# Altium schematic sheet Alarm system.SchDoc: Portable soldering station
size A3; SheetTotal: 1
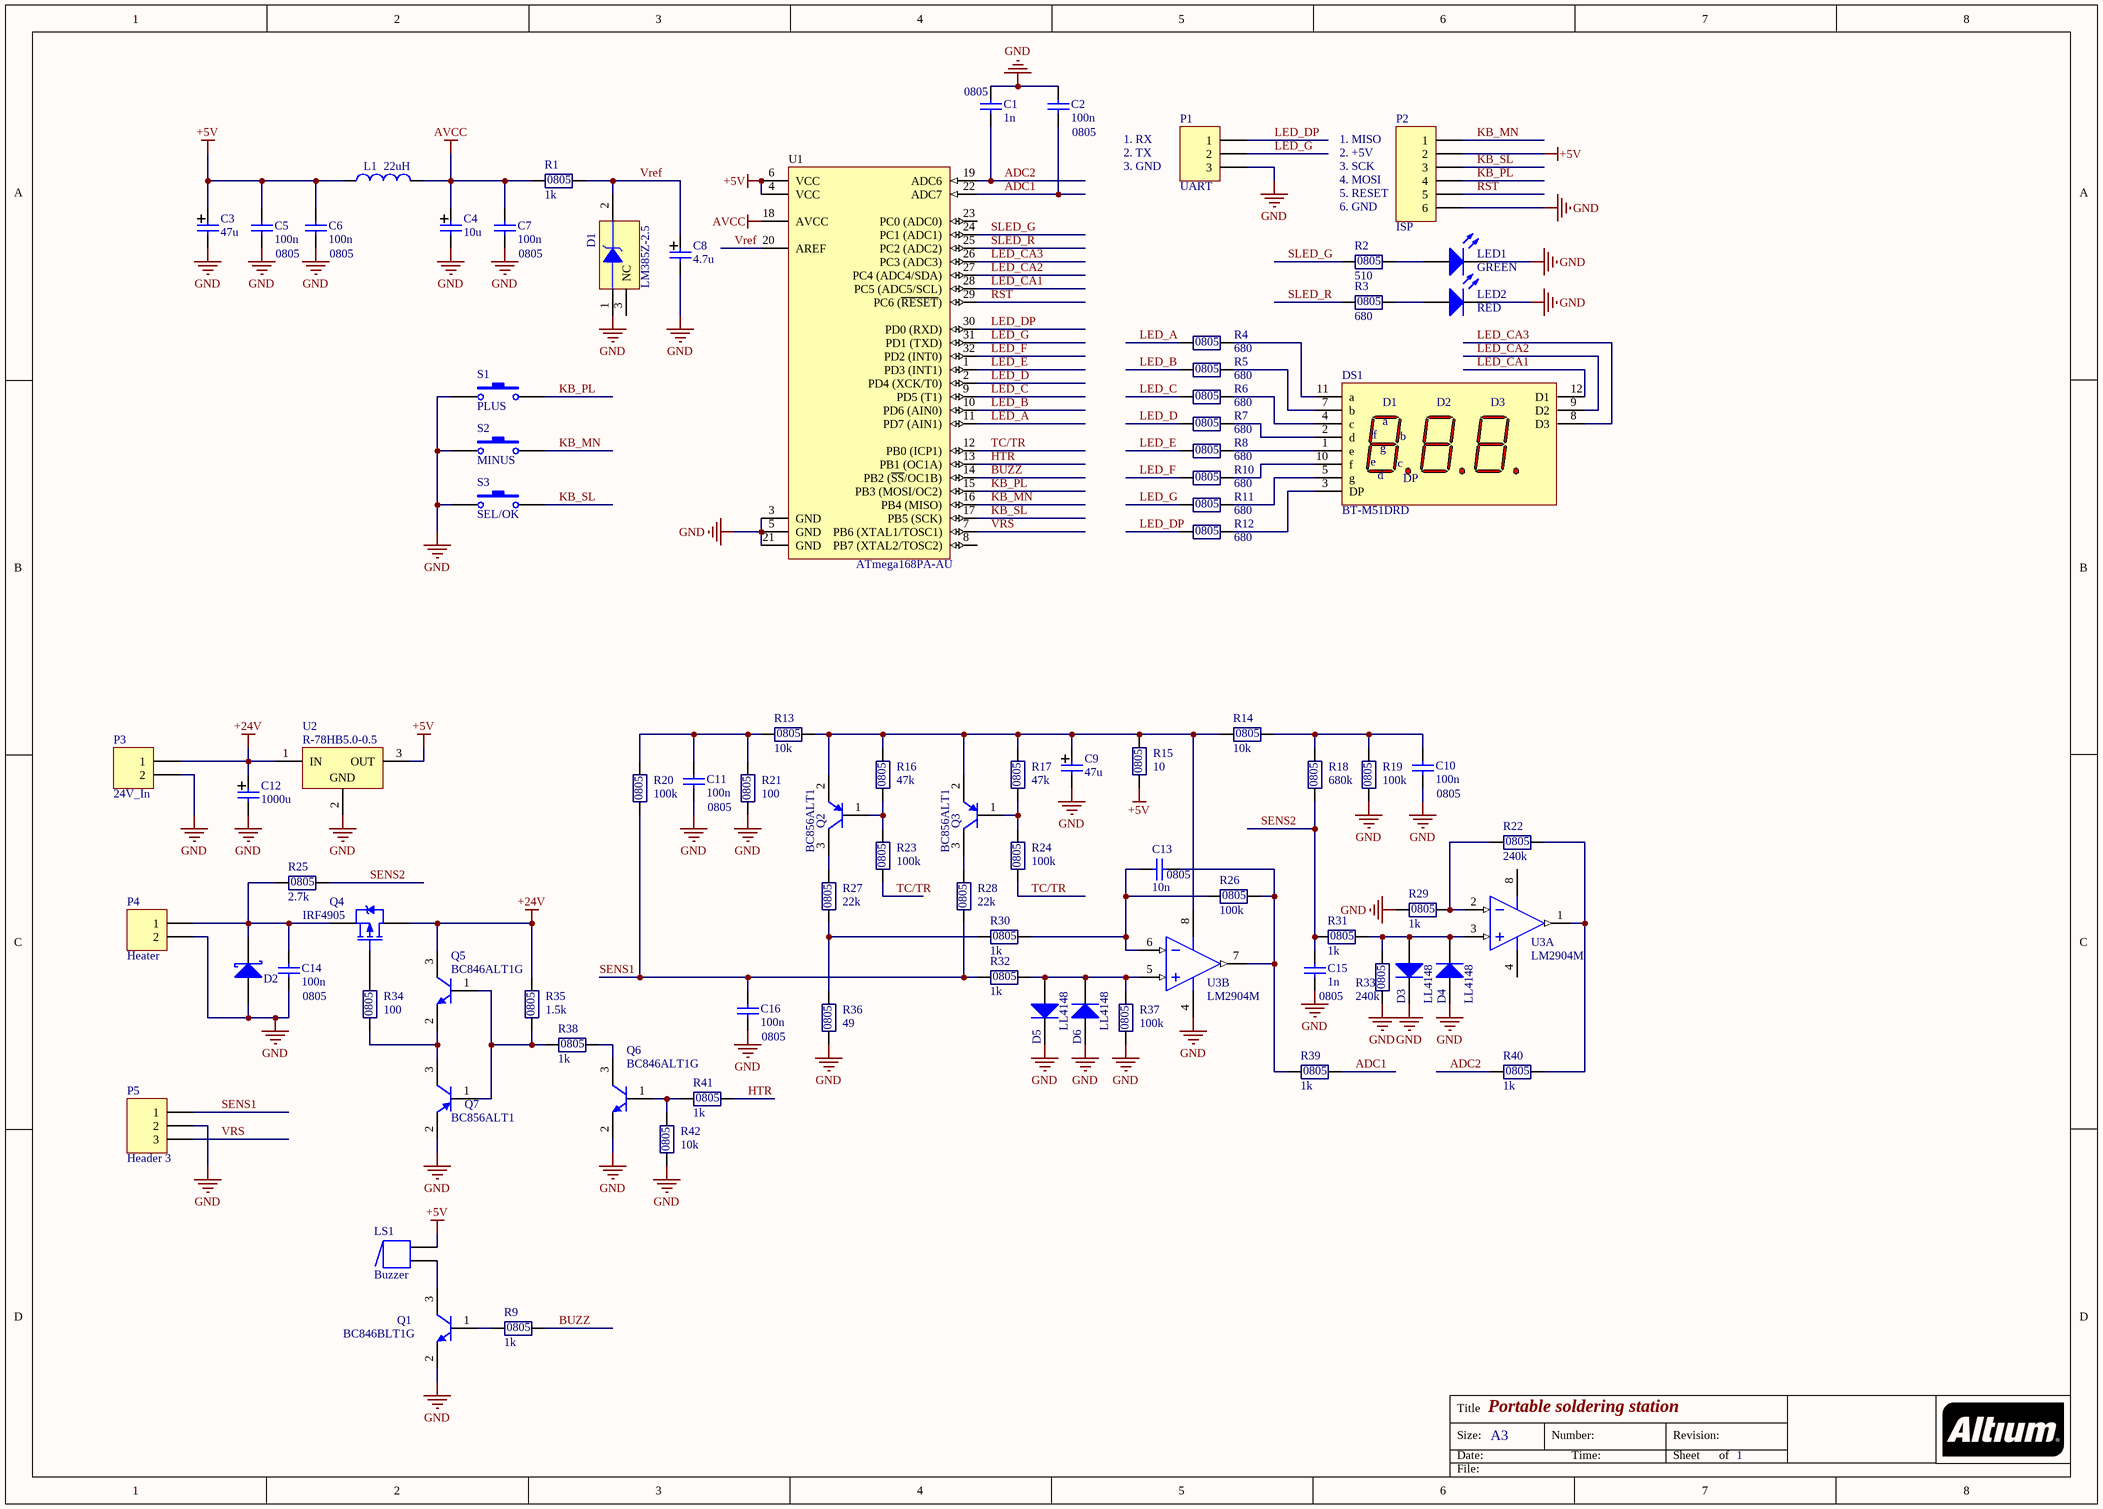
[diagram p0: Alarm system.SchDoc]

## Parts
C1  0805  value 1n  [CAPC2012X110N]
C2  0805  value 100n  [CAPC2012X110N]
C3  value 47u  [CAPPR250-500X1100]  (hidden comment: CAP_POL)
C4  value 10u  [CAPPR250-500X1100]  (hidden comment: CAP_POL)
C5  0805  value 100n  [CAPC2012X110N]
C6  0805  value 100n  [CAPC2012X110N]
C7  0805  value 100n  [CAPC2012X110N]
C8  value 4.7u  [CAPPR250-500X1100]  (hidden comment: CAP_POL)
C9  value 47u  [CAPPR250-500X1100]  (hidden comment: CAP_POL)
C10  0805  value 100n  [CAPC2012X110N]
C11  0805  value 100n  [CAPC2012X110N]
C12  value 1000u  [CAPPR500-1300X2150]  (hidden comment: CAP_POL)
C13  0805  value 10n  [CAPC2012X110N]
C14  0805  value 100n  [CAPC2012X110N]
C15  0805  value 1n  [CAPC2012X110N]
C16  0805  value 100n  [CAPC2012X110N]
D1  LM385Z-2.5  [TO-92AA-P127]
D2  Schottky  [DO-41]  (value not drawn)
D3  LL4148  [SOD80]
D4  LL4148  [SOD80]
D5  LL4148  [SOD80]
D6  LL4148  [SOD80]
DS1  BT-M51DRD  [BT-M51DRD]
L1  22uH  [IND_BOURNS_PM43]
LED1  GREEN  [LED_3MM_GREEN_1C-2A]
LED2  RED  [LED_3MM_RED_1C-2A]
LS1  Buzzer  [buzzer]
P1  UART  [961103-6404-AR]
P2  ISP  [961106-6404-AR]
P3  24V_In  [PHOENIX_1715721]
P4  Heater  [PHOENIX_1715721]
P5  Header 3  [961103-6404-AR]
Q1  BC846BLT1G  [SOT95P230X110-3N]
Q2  BC856ALT1  [SOT95P230X110-3N]
Q3  BC856ALT1  [SOT95P230X110-3N]
Q4  IRF4905  [TO-220AB]
Q5  BC846ALT1G  [SOT95P230X110-3N]
Q6  BC846ALT1G  [SOT95P230X110-3N]
Q7  BC856ALT1  [SOT95P230X110-3N]
R1  0805  value 1k  [RESC2012X50N]
R2  0805  value 510  [RESC2012X50N]
R3  0805  value 680  [RESC2012X50N]
R4  0805  value 680  [RESC2012X50N]
R5  0805  value 680  [RESC2012X50N]
R6  0805  value 680  [RESC2012X50N]
R7  0805  value 680  [RESC2012X50N]
R8  0805  value 680  [RESC2012X50N]
R9  0805  value 1k  [RESC2012X50N]
R10  0805  value 680  [RESC2012X50N]
R11  0805  value 680  [RESC2012X50N]
R12  0805  value 680  [RESC2012X50N]
R13  0805  value 10k  [RESC2012X50N]
R14  0805  value 10k  [RESC2012X50N]
R15  0805  value 10  [RESC2012X50N]
R16  0805  value 47k  [RESC2012X50N]
R17  0805  value 47k  [RESC2012X50N]
R18  0805  value 680k  [RESC2012X50N]
R19  0805  value 100k  [RESC2012X50N]
R20  0805  value 100k  [RESC2012X50N]
R21  0805  value 100  [RESC2012X50N]
R22  0805  value 240k  [RESC2012X50N]
R23  0805  value 100k  [RESC2012X50N]
R24  0805  value 100k  [RESC2012X50N]
R25  0805  value 2.7k  [RESC2012X50N]
R26  0805  value 100k  [RESC2012X50N]
R27  0805  value 22k  [RESC2012X50N]
R28  0805  value 22k  [RESC2012X50N]
R29  0805  value 1k  [RESC2012X50N]
R30  0805  value 1k  [RESC2012X50N]
R31  0805  value 1k  [RESC2012X50N]
R32  0805  value 1k  [RESC2012X50N]
R33  0805  value 240k  [RESC2012X50N]
R34  0805  value 100  [RESC2012X50N]
R35  0805  value 1.5k  [RESC2012X50N]
R36  0805  value 49  [RESC2012X50N]
R37  0805  value 100k  [RESC2012X50N]
R38  0805  value 1k  [RESC2012X50N]
R39  0805  value 1k  [RESC2012X50N]
R40  0805  value 1k  [RESC2012X50N]
R41  0805  value 1k  [RESC2012X50N]
R42  0805  value 10k  [RESC2012X50N]
S1  PLUS  [PB_OMRON_B3F-1070]
S2  MINUS  [PB_OMRON_B3F-1070]
S3  SEL/OK  [PB_OMRON_B3F-1070]
U1  ATmega168PA-AU  [32A_N]
U2  R-78HB5.0-0.5  [SIP-3]
U3  LM2904M  [M08A_N]  (parts A,B of 2)

## Nets
+5V: C3.1 C5.2 C6.2 L1.2 LS1.1 P2.2 R15.1 U1.4(VCC) U1.6(VCC) U2.3(OUT)
+24V: C12.1 P3.1 Q4.2(D) Q5.3(C) R35.2 U2.1(IN)
AVCC: C4.1 C7.2 L1.1 R1.1 U1.18(AVCC)
GND: C1.1 C2.1 C3.2 C4.2 C5.1 C6.1 C7.1 C8.2 C9.2 C10.1 C11.1 C12.2 C14.1 C15.1 C16.1 D1.1(A) D2.1(A) D3.2(K) D4.1(A) D5.2(K) D6.1(A) LED1.2(K) LED2.2(K) P1.3 P2.6 P3.2 P4.2 P5.2 Q1.2(E) Q6.2(E) Q7.2(E) R19.1 R21.1 R29.1 R33.1 R36.1 R37.1 R42.1 S1.1 S2.1 S3.1 U1.3(GND) U1.5(GND) U1.21(GND) U2.2(GND) U3.4(GND)
ADC1: C2.2 R39.2 U1.22(ADC7)
ADC2: C1.2 R40.1 U1.19(ADC6)
BUZZ: R9.2 U1.14(PB2_(~{SS}/OC1B))
HTR: R41.2 U1.13(PB1_(OC1A))
KB_MN: P2.1 S2.2 U1.16(PB4_(MISO))
KB_PL: P2.4 S1.2 U1.15(PB3_(MOSI/OC2))
KB_SL: P2.3 S3.2 U1.17(PB5_(SCK))
LED_A: R4.1 U1.11(PD7_(AIN1))
LED_B: R5.1 U1.10(PD6_(AIN0))
LED_C: R6.1 U1.9(PD5_(T1))
LED_CA1: DS1.12(D1) U1.28(PC5_(ADC5/SCL))
LED_CA2: DS1.9(D2) U1.27(PC4_(ADC4/SDA))
LED_CA3: DS1.8(D3) U1.26(PC3_(ADC3))
LED_D: R7.1 U1.2(PD4_(XCK/T0))
LED_DP: P1.1 R12.1 U1.30(PD0_(RXD))
LED_E: R8.1 U1.1(PD3_(INT1))
LED_F: R10.1 U1.32(PD2_(INT0))
LED_G: P1.2 R11.1 U1.31(PD1_(TXD))
RST: P2.5 U1.29(PC6_(~{RESET}))
SENS1: C16.2 P5.1 R20.1 R28.1 R32.1
SENS2: C15.2 R18.1 R25.2 R31.1
SLED_G: R2.1 U1.24(PC1_(ADC1))
SLED_R: R3.1 U1.25(PC2_(ADC2))
TC/TR: R23.1 R24.1 U1.12(PB0_(ICP1))
Vref: C8.1 D1.2(K) R1.2 U1.20(AREF)
VRS: P5.3 U1.7(PB6_(XTAL1/TOSC1))
NetC9_1: C9.1 Q2.2(E) Q3.2(E) R13.2 R14.1 R15.2 R16.2 R17.2 U3.8(V+)
NetC10_2: C10.2 R14.2 R18.2 R19.2
NetC11_2: C11.2 R13.1 R20.2 R21.2
NetC13_1: C13.1 R26.2 R39.1 U3.7(OUTB)
NetC13_2: C13.2 R26.1 R30.2 U3.6(INB-)
NetC14_2: C14.2 D2.2(K) P4.1 Q4.3(S) R25.1
NetD3_1: D3.1(A) D4.2(K) R31.2 R33.2 U3.3(INA+)
NetD5_1: D5.1(A) D6.2(K) R32.2 R37.2 U3.5(INB+)
NetDS1_1: DS1.1(e) R8.2
NetDS1_2: DS1.2(d) R7.2
NetDS1_3: DS1.3(DP) R12.2
NetDS1_4: DS1.4(c) R6.2
NetDS1_5: DS1.5(g) R11.2
NetDS1_7: DS1.7(b) R5.2
NetDS1_10: DS1.10(f) R10.2
NetDS1_11: DS1.11(a) R4.2
NetLED1_1: LED1.1(A) R2.2
NetLED2_1: LED2.1(A) R3.2
NetLS1_2: LS1.2 Q1.3(C)
NetQ1_1: Q1.1(B) R9.1
NetQ2_1: Q2.1(B) R16.1 R23.2
NetQ2_3: Q2.3(C) R27.2
NetQ3_1: Q3.1(B) R17.1 R24.2
NetQ3_3: Q3.3(C) R28.2
NetQ4_1: Q4.1(G) R34.2
NetQ5_1: Q5.1(B) Q7.1(B) R35.1 R38.1
NetQ5_2: Q5.2(E) Q7.3(C) R34.1
NetQ6_1: Q6.1(B) R41.1 R42.2
NetQ6_3: Q6.3(C) R38.2
NetR22_1: R22.1 R29.2 U3.2(INA-)
NetR22_2: R22.2 R40.2 U3.1(OUTA)
NetR27_1: R27.1 R30.1 R36.2

Not connected (* = marked no-connect by the designer): D1 3(NC); U1 8(PB7_(XTAL2/TOSC2)) 23(PC0_(ADC0))

## Notes on the sheet
- 1. RX
- 2. TX
- 3. GND
- 1. MISO
- 2. +5V
- 3. SCK
- 4. MOSI
- 5. RESET
- 6. GND
- Title
- Size:
- Date:
- A3
- Number:
- Time:
- Revision:
- Sheet
- of
- File:

## Library data of the parts
C1 C2 C5-C7 C10 C11 C13-C16 = CAP: MANUFACTURER P/N: *; MANUFACTURER: *
D1 = LM385Z-2.5: Micropower Voltage Reference Diode; Published: 17-Jul-2002; DatasheetVersion: 1988; PackageVersion: 1996; PackageReference: 29-04; Publisher: Altium Limited; PackageDescription: TO, Flat Index; 3 In-Line, Axial Leads; Body Dia. 4.8mm; Leads 0.48 x 0.5 mm (max); ComponentLink1Description: Manufacturer Link; ComponentLink1URL: http://www.onsemi.com/site/products/taxonomy/0,4438,503,00.html; ComponentLink2Description: Datasheet; ComponentLink2URL: http://www.onsemi.com/pub/Collateral/LM285-D.PDF
D2 = Schottky: Schottky Rectifier
D3-D6 = Diode
DS1 = Led_Ind_3_Digit
L1 = Drossel_AX
LED1 LED2 = LED0: Typical INFRARED GaAs LED; Published: 8-Jun-2000; LatestRevisionDate: 08-Jul-2005; LatestRevisionNote: Mech Layer 1 removed.; PackageReference: LED-0; Publisher: Altium Limited; PackageDescription: LED; 2 Leads
LS1 = Buzzer: Magnetic Transducer Buzzer; Published: 24-Mar-1999; LatestRevisionDate: 17-Dec-2003; LatestRevisionNote: Schematic revised, PCB Footprint replaced.; DatasheetVersion: 17-Dec-2003; PackageReference: ABSM-1574; Publisher: Altium Limited; PackageDescription: Magnetic Transducer Buzzer; ComponentLink1Description: Manufacturer Link; ComponentLink1URL: http://www.megastar.com/linecard/buzzmode/index.php
P1 P5 = Header 3: Header, 3-Pin; LatestRevisionDate: 17-Jul-2002; LatestRevisionNote: Re-released for DXP Platform.; Publisher: Altium Limited
P2 = Header 6: Header, 6-Pin; LatestRevisionDate: 17-Jul-2002; LatestRevisionNote: Re-released for DXP Platform.; Publisher: Altium Limited
P3 P4 = Header 2: Header, 2-Pin; LatestRevisionDate: 17-Jul-2002; LatestRevisionNote: Re-released for DXP Platform.; Publisher: Altium Limited
Q1 = BC846BLT1G: General Purpose Transistor, NPN Silicon, 3-Pin SOT-23, Pb-Free, Tape and Reel; Manufacturer: On Semiconductor; fT Min (MHz): 100; IC Continuous (A): 0.1; DatasheetVersion: Rev. 11; PackageVersion: Rev. AP, 11/2009; PackageReference: SOT-23-3-318-08; PackageDescription: 3-Pin Small Outline Transistor, Body 2.92 x 1.3 mm, Pitch 0.95 mm; Supplier 1: Digi-Key; Supplier Part Number 1: BC846BLT1GOSTR-ND; Supplier 2: Digi-Key; Supplier Part Number 2: BC846BLT1GOSCT-ND; Supplier 3: Digi-Key; Supplier Part Number 3: BC846BLT1GOSDKR-ND; Supplier 4: Farnell; Supplier Part Number 4: 2317817; Supplier 5: Newark; Supplier Part Number 5: 67R1292; Supplier 6: Newark; Supplier Part Number 6: 88H4565; Supplier 7: Mouser; Supplier Part Number 7: 863-BC846BLT1G; Packing: Tape and Reel; Polarity: NPN; RoHS: TRUE; Mounting Technology: Surface Mount; PartNumber: BC846BLT1G; ComponentLink1Description: Manufacturer URL; ComponentLink1URL: http://www.onsemi.com/; ComponentLink2Description: Datasheet; ComponentLink2URL: http://www.onsemi.cn/pub_link/Collateral/BC846ALT1-D.PDF; ComponentLink3Description: Package Specification; ComponentLink3URL: http://www.onsemi.cn/pub_link/Collateral/318-08.PDF
Q2 Q3 Q7 = BC856ALT1: General Purpose Transistor, PNP Silicon, 3-Pin SOT-23, Tape and Reel; Manufacturer: On Semiconductor; fT Min (MHz): 100; IC Continuous (A): -0.1; DatasheetVersion: Rev. 13; PackageVersion: Rev. AP, 11/2009; PackageReference: SOT-23-3-318-08; PackageDescription: 3-Pin Small Outline Transistor, Body 2.92 x 1.3 mm, Pitch 0.95 mm; Supplier 1: Digi-Key; Supplier Part Number 1: BC856ALT1OSCT-ND; Packing: Tape and Reel; Polarity: PNP; RoHS: FALSE; Mounting Technology: Surface Mount; PartNumber: BC856ALT1; ComponentLink1Description: Manufacturer URL; ComponentLink1URL: http://www.onsemi.com/; ComponentLink2Description: Datasheet; ComponentLink2URL: http://www.onsemi.cn/pub_link/Collateral/BC856ALT1-D.PDF; ComponentLink3Description: Package Specification; ComponentLink3URL: http://www.onsemi.cn/pub_link/Collateral/318-08.PDF
Q4 = IRF4905: HEXFET Power MOSFET; Note: Pin 2 is electrically connected to pin 4.; Published: 8-Jun-2000; LatestRevisionDate: 17-Jul-2002; LatestRevisionNote: Re-released for DXP Platform.; DatasheetVersion: Aug-1997; PackageVersion: Feb-1997; PackageReference: TO-220AB; Publisher: Altium Limited; PackageDescription: TO, Thru-Hole, Vertical, Heatsink Mounted; 3 In-Line Leads; Pitch 2.54 mm; ComponentLink1Description: Manufacturer Link; ComponentLink1URL: http://www.irf.com/; ComponentLink2Description: Datasheet; ComponentLink2URL: http://www.irf.com/product-info/datasheets/data/irf4905.pdf
Q5 Q6 = BC846ALT1G: General Purpose Transistor, NPN Silicon, 3-Pin SOT-23, Pb-Free, Tape and Reel; Manufacturer: On Semiconductor; fT Min (MHz): 100; IC Continuous (A): 0.1; DatasheetVersion: Rev. 11; PackageVersion: Rev. AP, 11/2009; PackageReference: SOT-23-3-318-08; PackageDescription: 3-Pin Small Outline Transistor, Body 2.92 x 1.3 mm, Pitch 0.95 mm; Supplier 1: Digi-Key; Supplier Part Number 1: BC846ALT1GOSTR-ND; Supplier 2: Digi-Key; Supplier Part Number 2: BC846ALT1GOSCT-ND; Supplier 3: Digi-Key; Supplier Part Number 3: BC846ALT1GOSDKR-ND; Supplier 4: Farnell; Supplier Part Number 4: 1459036; Supplier 5: Farnell; Supplier Part Number 5: 2317811; Supplier 6: Farnell; Supplier Part Number 6: 1459036RL; Supplier 7: Newark; Supplier Part Number 7: 67R1291; Supplier 8: Newark; Supplier Part Number 8: 88H4564; Supplier 9: Mouser; Supplier Part Number 9: 863-BC846ALT1G; Packing: Tape and Reel; Polarity: NPN; RoHS: TRUE; Mounting Technology: Surface Mount; PartNumber: BC846ALT1G; ComponentLink1Description: Manufacturer URL; ComponentLink1URL: http://www.onsemi.com/; ComponentLink2Description: Datasheet; ComponentLink2URL: http://www.onsemi.cn/pub_link/Collateral/BC846ALT1-D.PDF; ComponentLink3Description: Package Specification; ComponentLink3URL: http://www.onsemi.cn/pub_link/Collateral/318-08.PDF
R1-R42 = Resistor: MANUFACTURER P/N: *; MANUFACTURER: *
S1-S3 = SW-PB: Switch; Published: 24-Mar-1999; LatestRevisionDate: 17-Jul-2002; LatestRevisionNote: Re-released for DXP Platform.; PackageReference: SPST-2; Publisher: Altium Limited; PackageDescription: Switch; 2 Leads
U1 = ATmega8A-AU: 8-bit AVR Microcontroller, 8KB Flash, 512 Bytes EEPROM, 1KB SRAM, 32-pin TQFP, Industrial Grade (-40°C to 85°C); Published: 1-Apr-2010; DatasheetVersion: revC, Jul-2009; PackageVersion: revB, Oct-2001; PackageReference: 32A; Publisher: Altium Limited; PackageDescription: 32-Lead, 7x7x1.0 mm Body, 0.8mm Lead Pitch, Thin Profile Plastic Quad Flat Package (TQFP); Supplier 1: Digi-Key; Supplier Part Number 1: ATMEGA8A-AU-ND; Supplier 2: Farnell; Supplier Part Number 2: 1748532; Supplier 3: Mouser; Supplier Part Number 3: 556-ATMEGA8A-AU; Code_JEDEC: MS-026-ABA; ComponentLink1Description: Manufacturer Link; ComponentLink1URL: http://www.atmel.com/products/avr/default.asp?; ComponentLink2Description: ATmega8A Datasheet; ComponentLink2URL: http://www.atmel.com/dyn/resources/prod_documents/doc8159.pdf; ComponentLink3Description: ATmega8A Summary; ComponentLink3URL: http://www.atmel.com/dyn/resources/prod_documents/8159S.pdf; ComponentLink4Description: Atmel.com Home; ComponentLink4URL: http://www.atmel.com
U2 = MC7805ACT: 3-Terminal Positive Fixed Voltage Regulator; Manufacturer Part Number: R-78E5.0-1.0; Published: 17-Jul-2002; DatasheetVersion: 1988; PackageReference: 221A-04; Supplier Part Number 1: 945-2201-ND; Code_JEDEC: TO-262-AA; ComponentLink1Description: Manufacturer Link; ComponentLink1URL: http://www.onsemi.com/site/products/taxonomy/0,4438,503,00.html; ComponentLink2Description: Datasheet; ComponentLink2URL: http://www.onsemi.com/pub/Collateral/MC7800-D.PDF
U3 = LM2904M: Low Power Dual Operational Amplifier, 8-pin Narrow SOIC; Manufacturer: National Semiconductor; PackageTopMarking: NSZXTT*LM*2904M; PowerWise: N; CompType: Amplifiers; Published: 4-Dec-2008; LatestRevisionDate: 13-Jan-2009; LatestRevisionNote: Sim Model Added.; DatasheetVersion: Oct-2005; PackageVersion: revM, May-2009; PackageReference: M08A; Publisher: Altium Limited; PackageDescription: SOIC Narrow, 4.9 x 3.9 x 1.45mm, 8 Lead, 1.27mm Pitch; Supplier 1: Farnell; Supplier Part Number 1: 9486860; PartNumber: LM2904M; RoHS: N; PinCount: 8; Code_JEDEC: MS-012-AA; Code_IPC: SOIC127P600-8; ComponentLink1Description: LM2904 Datasheet; ComponentLink1URL: http://www.national.com/ds/LM/LM2904.pdf; ComponentLink2Description: LM2904 Web Page; ComponentLink2URL: http://www.national.com/pf/LM/LM2904.html; ComponentLink3Description: M08A Package Page; ComponentLink3URL: http://www.national.com/packaging/folders/m08a.html